# EAGLE design sumovore (EAGLE 4.14)
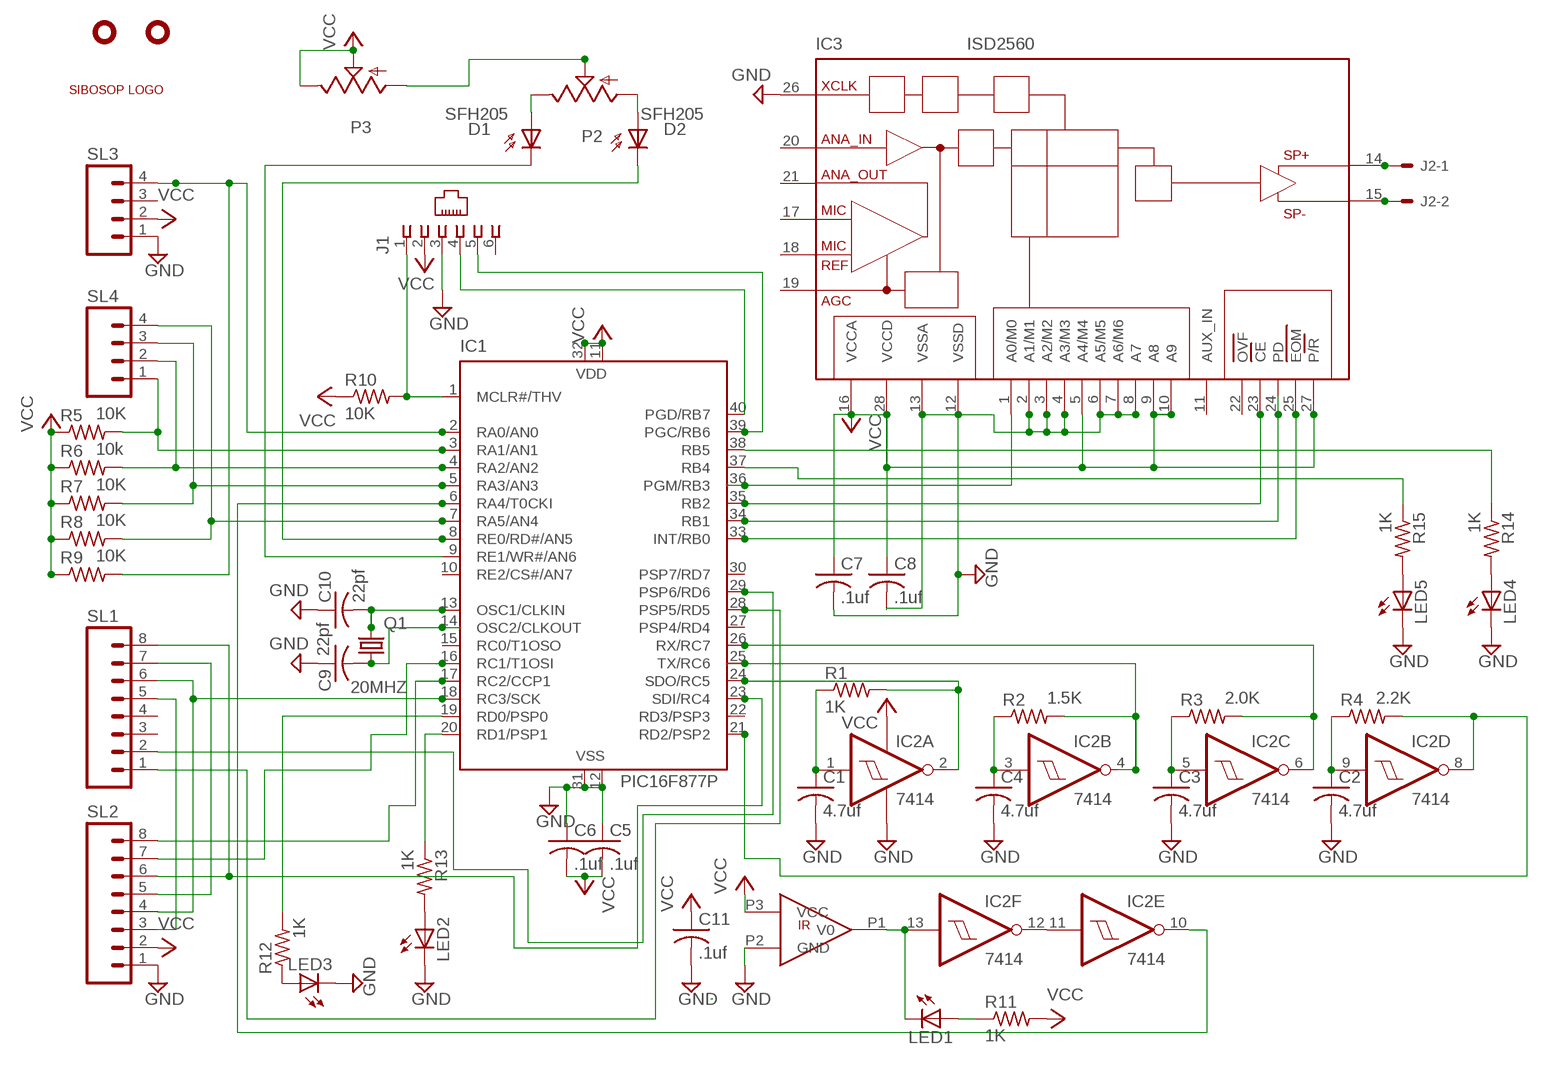
[diagram p0: schematic, sheet 1]

## Parts
C1  4.7uf  C-US050-024X044  [C050-024X044]
C2  4.7uf  C-US050-024X044  [C050-024X044]
C3  4.7uf  C-US050-024X044  [C050-024X044]
C4  4.7uf  C-US050-024X044  [C050-024X044]
C5  .1uf  C-US025-024X044  [C025-024X044]
C6  .1uf  C-US025-024X044  [C025-024X044]
C7  .1uf  C-US025-024X044  [C025-024X044]
C8  .1uf  C-US025-024X044  [C025-024X044]
C9  22pf  C-US025-024X044  [C025-024X044]
C10  22pf  C-US025-024X044  [C025-024X044]
C11  .1uf  C-US025-024X044  [C025-024X044]
D1  SFH205  [SFH205]
D2  SFH205  [SFH205]
IC1  PIC16F877P  [DIL40]
IC2  7414  [DIL14]
IC3  ISD2560  [DIL28-6]
J1  520250-3  [520250-3]
J2  22-27-2021-02  [6410-02]
LED1  LED5MM  [LED5MM]
LED2  LEDSQR2X5  [LED2X5]
LED3  LEDSQR2X5  [LED2X5]
LED4  LEDSQR2X5  [LED2X5]
LED5  LEDSQR2X5  [LED2X5]
P2  TRIMPOT  [RJ6S]
P3  TRIMPOT  [RJ6S]
Q1  20MHZ  CRYTALHC49S  [HC49/S]
R1  1K  R-US_0204/2V  [0204V]
R2  1.5K  R-US_0204/2V  [0204V]
R3  2.0K  R-US_0204/2V  [0204V]
R4  2.2K  R-US_0204/2V  [0204V]
R5  10K  R-US_0204/2V  [0204V]
R6  10k  R-US_0204/2V  [0204V]
R7  10K  R-US_0204/2V  [0204V]
R8  10K  R-US_0204/2V  [0204V]
R9  10K  R-US_0204/2V  [0204V]
R10  10K  R-US_0204/2V  [0204V]
R11  1K  R-US_0204/2V  [0204V]
R12  1K  R-US_0204/2V  [0204V]
R13  1K  R-US_0204/2V  [0204V]
R14  1K  R-US_0204/2V  [0204V]
R15  1K  R-US_0204/2V  [0204V]
SL1  M08  [08P]
SL2  M08  [08P]
SL3  M04  [04P]
SL4  M04  [04P]
U$1  LOGO  [LOGO]
U$2  PNA4062M  [LSTLR103NC-001]
U$4  HOLE-125  [HOLE-125]
U$8  HOLE-125  [HOLE-125]

## Nets
GND: C1.2 C2.2 C3.2 C4.2 C5.1 C6.1 C7.2 C8.2 C9.1 C10.1 C11.2 IC1.12(VSS) IC1.31(VSS) IC2.7(A:GND) IC3.2(A1/M1) IC3.3(A2/M2) IC3.4(A3/M3) IC3.6(A5/M5) IC3.7(A6/M6) IC3.8(A7) IC3.12(VSSD) IC3.13(VSSA) IC3.26(XCLK) J1.3 LED2.K(C) LED3.K(C) LED4.K(C) LED5.K(C) SL2.1 SL3.1 U$2.P2(GND)
N$1: C9.2 IC1.14(OSC2/CLKOUT) Q1.1
N$2: C10.2 IC1.13(OSC1/CLKIN) Q1.2
N$3: IC1.1(MCLR#/THV) J1.1 R10.2
N$4: IC1.40(PGD/RB7) J1.4
N$5: IC1.39(PGC/RB6) J1.5
N$6: IC3.15(SP-) J2.2
N$7: IC3.14(SP+) J2.1
N$8: IC1.33(INT/RB0) IC3.25(EOM)
N$9: IC2.11(E:I) IC2.12(F:O)
N$10: IC1.34(RB1) IC3.24(PD)
N$11: IC1.19(RD0/PSP0) R12.2
N$12: IC1.35(RB2) IC3.23(CE)
N$13: IC1.36(PGM/RB3) IC3.1(A0/M0)
N$14: IC1.3(RA1/AN1) R5.2 SL4.1
N$15: IC1.4(RA2/AN2) R6.2 SL4.2
N$16: IC1.2(RA0/AN0) R9.2 SL3.4
N$17: IC1.5(RA3/AN3) R7.2 SL4.3
N$18: IC1.7(RA5/AN4) R8.2 SL4.4
N$19: SL1.5 SL2.3
N$20: LED3.A R12.1
N$21: SL1.7 SL2.5
N$22: IC1.23(SDI/RC4) SL1.8 SL2.6
N$23: IC1.16(RC1/T1OSI) SL2.7
N$24: IC1.17(RC2/CCP1) SL2.8
N$25: IC1.18(RC3/SCK) SL1.6 SL2.4
N$26: IC1.20(RD1/PSP1) R13.1
N$27: LED2.A R13.2
N$28: IC1.29(PSP6/RD6) SL1.2
N$29: IC1.28(PSP5/RD5) SL1.1
N$31: IC2.13(F:I) LED1.K(C) U$2.P1(V0)
N$32: LED4.A R14.2
N$33: IC1.6(RA4/T0CKI) IC2.10(E:O)
N$34: C1.1 IC2.1(A:I) R1.1
N$35: IC1.24(SDO/RC5) IC2.2(A:O) R1.2
N$36: D2.A P2.A
N$37: C4.1 IC2.3(B:I) R2.1
N$38: IC1.25(TX/RC6) IC2.4(B:O) R2.2
N$39: C2.1 IC2.9(D:I) R4.1
N$40: D2.K(C) IC1.8(RE0/RD#/AN5)
N$41: C3.1 IC2.5(C:I) R3.1
N$42: IC1.26(RX/RC7) IC2.6(C:O) R3.2
N$43: D1.A P2.E
N$44: D1.K(C) IC1.9(RE1/WR#/AN6)
N$45: IC1.21(RD2/PSP2) IC2.8(D:O) R4.2
N$46: LED5.A R15.2
N$47: IC1.38(RB5) R14.1
N$48: LED1.A R11.1
N$49: IC1.37(RB4) R15.1
N$52: P2.S P3.A
VCC: C5.2 C6.2 C7.1 C8.1 C11.1 IC1.11(VDD) IC1.32(VDD) IC2.14(A:VCC) IC3.5(A4/M4) IC3.9(A8) IC3.10(A9) IC3.16(VCCA) IC3.27(P/R) IC3.28(VCCD) J1.2 P3.E P3.S R5.1 R6.1 R7.1 R8.1 R9.1 R10.1 R11.2 SL2.2 SL3.2 U$2.P3(VCC)
Unconnected: IC1.10(RE2/CS#/AN7) IC1.15(RC0/T1OSO) IC1.22(RD3/PSP3) IC1.27(PSP4/RD4) IC1.30(PSP7/RD7) IC3.11(AUX_IN) IC3.17(MIC) IC3.18(MIC_REF) IC3.19(AGC) IC3.20(ANA_IN) IC3.21(ANA_OUT) IC3.22(OVF) J1.6 SL1.3 SL1.4 SL3.3

## Library data of the parts
C1-C11 = rcl:C-US: CAPACITOR, American symbol
D1 D2 = opto-trans-siemens:SFH205: PHOTO DIODE
IC1 = microchip:PIC16F87*: MICROCONTROLLER
IC2 = sibosop:7414
IC3 = sibosop:ISD2560
J1 = con-amp:520250-3: AMP connector
J2 = ep_molex_6410_7395-02:22-?-02: CONNECTOR wire to board 2.54 mm (.1 inch) pitch header
LED1-LED5 = led:LED: LED OSRAM: - CHIPLED LG R971, LG N971, LY N971, LG Q971, LY Q971, LO R971, LY R971 LH N974, LH R974 LS Q976, LO Q976, LY Q976 LO Q996 - Hyper CHIPLED LW Q18S LB Q993, LB Q99A, LB R99A - SideLED LS A670, LO A670, LY A670, LG A670, LP A670 LB A673, LV A673, LT A673, LW A673 LH A674 LY A675 LS A676, LA A676, LO A676, LY A676, LW A676 LS A679, LY A679, LG A679 - Hyper Micro SIDELED® LS Y876, LA Y876, LO Y876, LY Y876 LT Y87S - SmartLED LW L88C, LW L88S LB L89C, LB L89S, LG L890 LS L89K, LO L89K, LY L89K LS L896, LA L896, LO L896, LY L896 - TOPLED LS T670, LO T670, LY T670, LG T670, LP T670 LSG T670, LSP T670, LSY T670, LOP T670, LYG T670 LG T671, LOG T671, LSG T671 LB T673, LV T673, LT T673, LW T673 LH T674 LS T676, LA T676, LO T676, LY T676, LB T676, LH T676, LSB T676, LW T676 LB T67C, LV T67C, LT T67C, LS T67K, LO T67K, LY T67K, LW E67C LS E67B, LA E67B, LO E67B, LY E67B, LB E67C, LV E67C, LT E67C LW T67C LS T679, LY T679, LG T679 LS T770, LO T770, LY T770, LG T770, LP T770 LB T773, LV T773, LT T773, LW T773 LH T774 LS E675, LA E675, LY E675, LS T675 LS T776, LA T776, LO T776, LY T776, LB T776 LHGB T686 LT T68C, LB T68C - Hyper Mini TOPLED® LB M676 - Mini TOPLED Santana® LG M470 LS M47K, LO M47K, LY M47K Source: http://www.osram.convergy.de/
P2 P3 = sibosop:TRIMPOT
Q1 = crystal:CRYTAL: CRYSTAL
R1-R15 = rcl:R-US_: RESISTOR, American symbol
SL1 SL2 = sibosop:M08: AMP QUICK CONNECTOR
SL3 SL4 = sibosop:M04: AMP QUICK CONNECTOR
U$1 = sibosop:LOGO
U$2 = sibosop:PNA4062M
U$4 U$8 = sibosop:HOLE-125

## Board
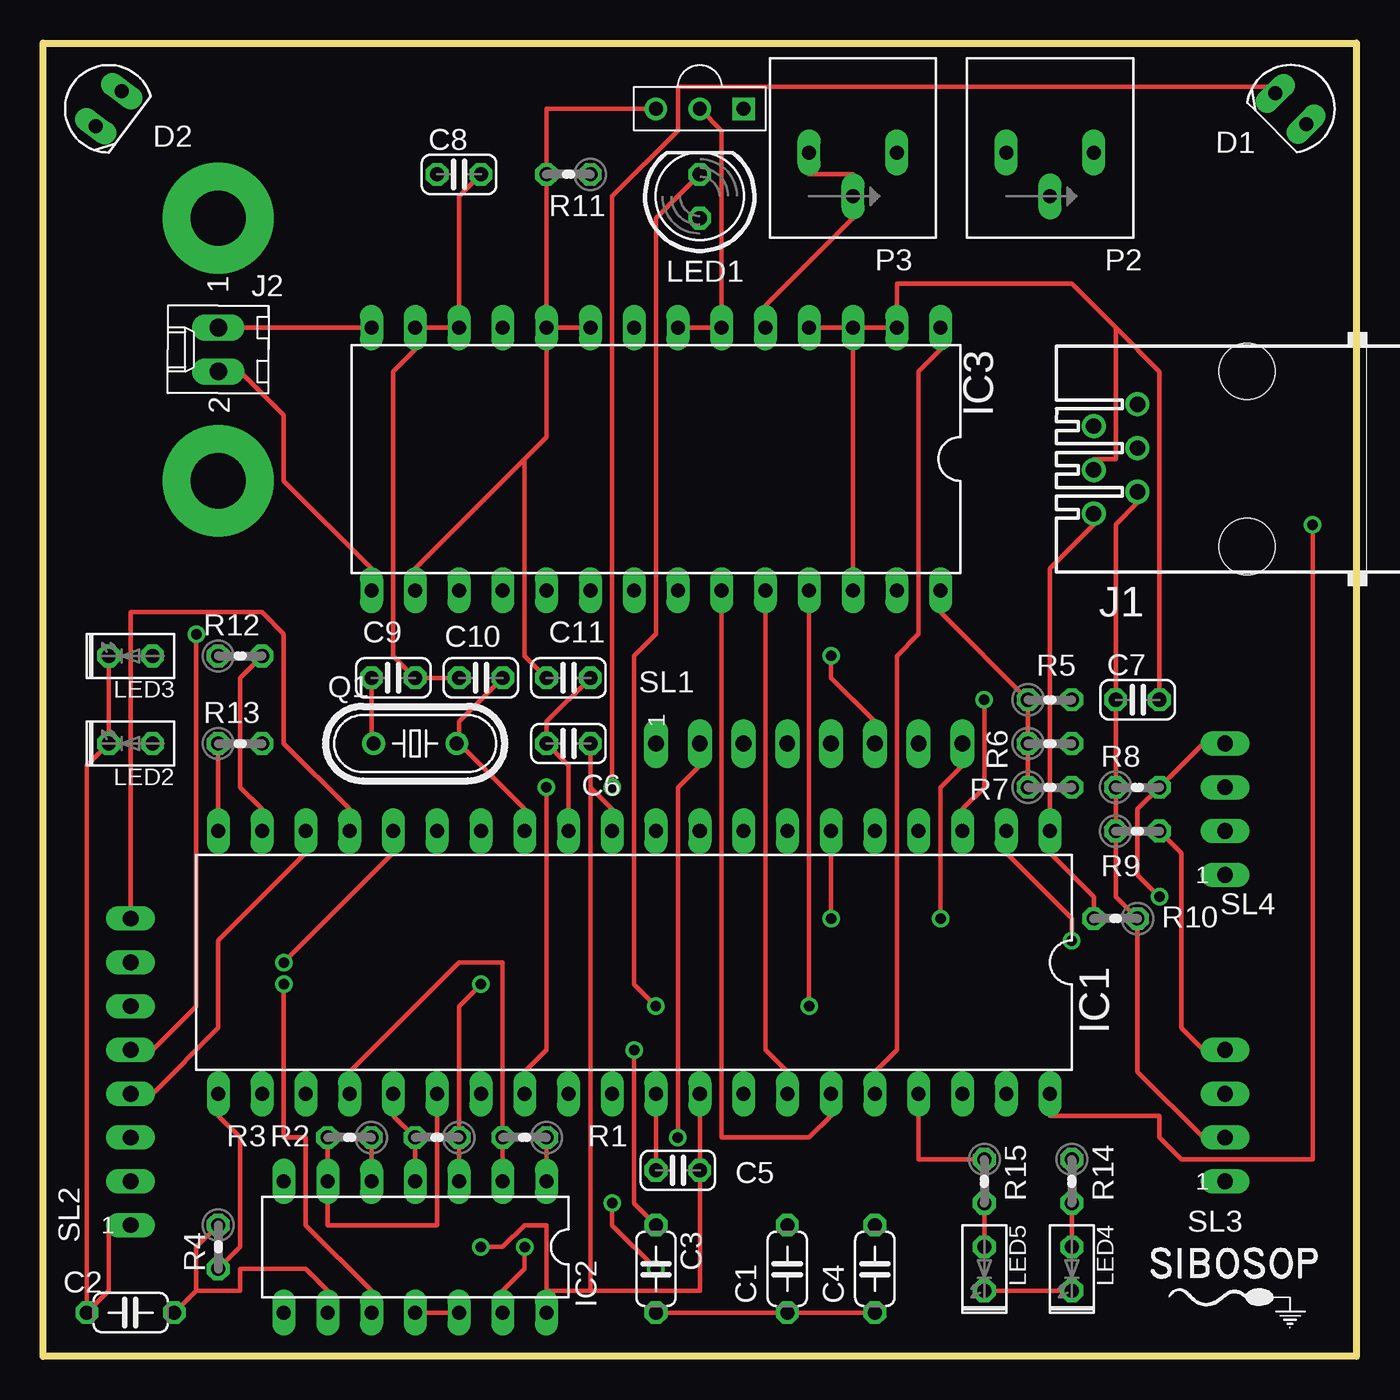
[diagram p1: board, top side]
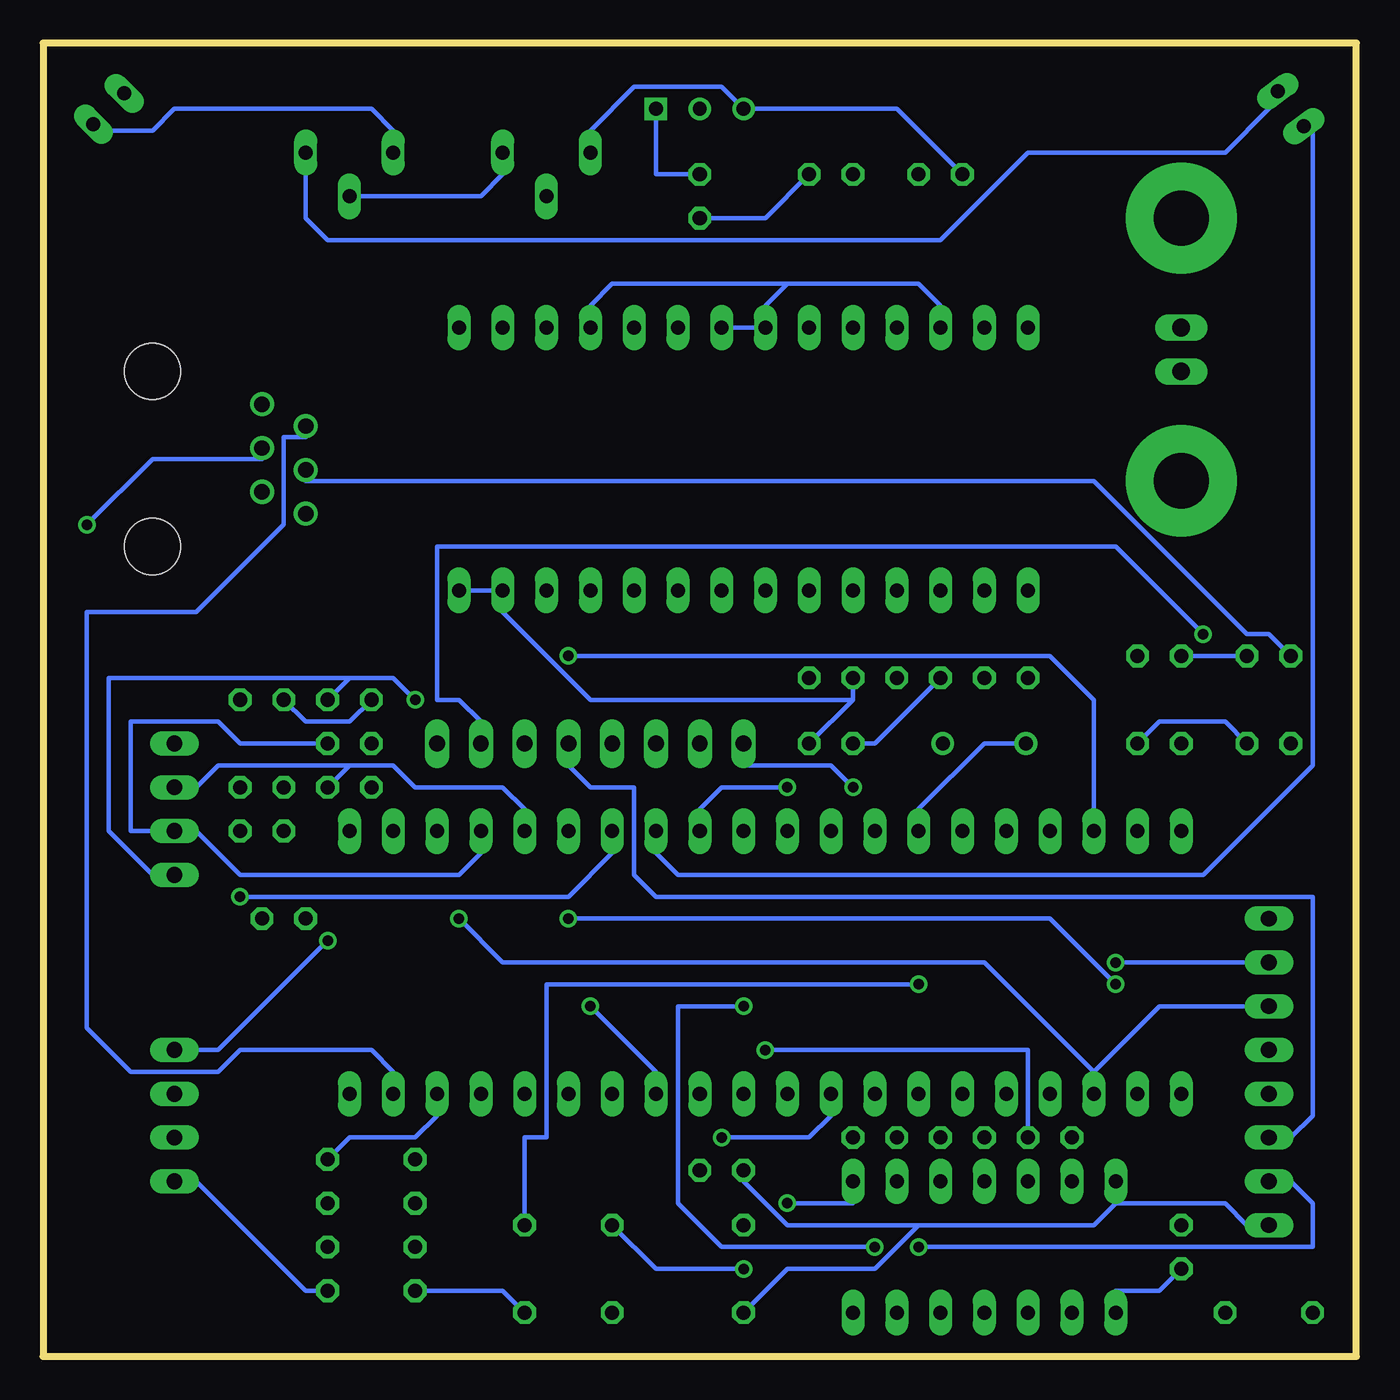
[diagram p2: board, bottom side, seen from below]

Size 76.2 x 76.2 mm. Coordinates in mm from the lower left corner, seen from the top.
Outline: 0,0 0,76.2 76.2,76.2 76.2,0 0,0
Copper layers (1*16): Top 0.035mm / dielectric 1.5mm / Bottom 0.035mm
Design rules "default": minimum track width 10mil, minimum drill 24mil, track to track 8mil, track to pad 8mil, pad to pad 8mil, via to via 8mil, smd to smd 8mil, copper to edge 40mil, drill to drill 8mil, minimum pad ring 10mil, minimum via ring 8mil, stop-mask expansion 4mil, vias tented up to drill 0mil, thermal gap 10mil

### Footprints (pad centres in the part's own frame; a part is rotated, then mirrored left to right if it is on the bottom)
C050-024X044 = drill 0.813 octagon: 1 -2.54,0; 2 2.54,0
C025-024X044 = drill 0.813 octagon: 1 -1.27,0; 2 1.27,0
SFH205 = drill 0.813 long: A 0,-1.27; K 0,1.27
DIL40 = drill 0.813 long: 1 -24.13,-7.62; 2 -21.59,-7.62; 3 -19.05,-7.62; 4 -16.51,-7.62; 5 -13.97,-7.62; 6 -11.43,-7.62; 7 -8.89,-7.62; 8 -6.35,-7.62; 9 -3.81,-7.62; 10 -1.27,-7.62; 11 1.27,-7.62; 12 3.81,-7.62; 13 6.35,-7.62; 14 8.89,-7.62; 15 11.43,-7.62; 16 13.97,-7.62; 17 16.51,-7.62; 18 19.05,-7.62; 19 21.59,-7.62; 20 24.13,-7.62; 21 24.13,7.62; 22 21.59,7.62; 23 19.05,7.62; 24 16.51,7.62; 25 13.97,7.62; 26 11.43,7.62; 27 8.89,7.62; 28 6.35,7.62; 29 3.81,7.62; 30 1.27,7.62; 31 -1.27,7.62; 32 -3.81,7.62; 33 -6.35,7.62; 34 -8.89,7.62; 35 -11.43,7.62; 36 -13.97,7.62; 37 -16.51,7.62; 38 -19.05,7.62; 39 -21.59,7.62; 40 -24.13,7.62
DIL14 = drill 0.813 long: 1 -7.62,-3.81; 2 -5.08,-3.81; 3 -2.54,-3.81; 4 0,-3.81; 5 2.54,-3.81; 6 5.08,-3.81; 7 7.62,-3.81; 8 7.62,3.81; 9 5.08,3.81; 10 2.54,3.81; 11 0,3.81; 12 -2.54,3.81; 13 -5.08,3.81; 14 -7.62,3.81
DIL28-6 = drill 0.813 long: 1 -16.51,-7.62; 2 -13.97,-7.62; 3 -11.43,-7.62; 4 -8.89,-7.62; 5 -6.35,-7.62; 6 -3.81,-7.62; 7 -1.27,-7.62; 8 1.27,-7.62; 9 3.81,-7.62; 10 6.35,-7.62; 11 8.89,-7.62; 12 11.43,-7.62; 13 13.97,-7.62; 14 16.51,-7.62; 15 16.51,7.62; 16 13.97,7.62; 17 11.43,7.62; 18 8.89,7.62; 19 6.35,7.62; 20 3.81,7.62; 21 1.27,7.62; 22 -1.27,7.62; 23 -3.81,7.62; 24 -6.35,7.62; 25 -8.89,7.62; 26 -11.43,7.62; 27 -13.97,7.62; 28 -16.51,7.62
520250-3 = drill 0.889 round: 1 -3.175,8.89; 2 -1.905,6.35; 3 -0.635,8.89; 4 0.635,6.35; 5 1.905,8.89; 6 3.175,6.35 | hole 3.251: -5.08,0; 5.08,0
6410-02 = drill 1.016 long: 1 1.27,0; 2 -1.27,0
LED5MM = drill 0.813 octagon: A -1.27,0; K 1.27,0
LED2X5 = drill 0.813 octagon: A -1.27,0; K 1.27,0
RJ6S = drill 0.813 long: A 2.54,0; E -2.54,0; S 0,-2.54
HC49/S = drill 0.813 round: 1 -2.413,0; 2 2.413,0
0204V = drill 0.813 octagon: 1 -1.27,0; 2 1.27,0
08P = drill 0.914 long: 1 -8.89,0; 2 -6.35,0; 3 -3.81,0; 4 -1.27,0; 5 1.27,0; 6 3.81,0; 7 6.35,0; 8 8.89,0
04P = drill 0.914 long: 1 -3.81,0; 2 -1.27,0; 3 1.27,0; 4 3.81,0
LSTLR103NC-001 = drill 0.8 square: P1 -2.54,0 | drill 0.8 round: P2 0,0; P3 2.54,0
HOLE-125 = drill 3.2 pad 6.452 round: P$1 0,0

### Placement (x,y rotation side)
C1  43.18,5.08 270 top
C2  5.08,2.54 180 top
C3  35.56,5.08 270 top
C4  48.26,5.08 270 top
C5  36.83,10.79 0 top
C6  30.48,35.56 0 top
C7  63.5,38.1 0 top
C8  24.13,68.58 0 top
C9  20.32,39.37 180 top
C10  25.4,39.37 0 top
C11  30.48,39.37 0 top
D1  72.39,72.39 45 top
D2  3.81,72.39 143.3 top
IC1  34.29,22.86 180 top
IC2  21.59,6.35 180 top
IC3  35.56,52.07 180 top
J1  69.85,52.07 90 top
J2  10.16,58.42 90 top
LED1  38.1,67.31 90 top
LED2  5.08,35.56 180 top
LED3  5.08,40.64 180 top
LED4  59.69,5.08 270 top
LED5  54.61,5.08 270 top
P2  58.42,69.85 0 top
P3  46.99,69.85 0 top
Q1  21.59,35.56 0 top
R1  27.94,12.7 180 top
R2  22.86,12.7 180 top
R3  17.78,12.7 180 top
R4  10.16,6.35 270 top
R5  58.42,38.1 0 top
R6  58.42,35.56 0 top
R7  58.42,33.02 0 top
R8  63.5,33.02 0 top
R9  63.5,30.48 0 top
R10  62.23,25.4 180 top
R11  30.48,68.58 180 top
R12  11.43,40.64 0 top
R13  11.43,35.56 0 top
R14  59.69,10.16 270 top
R15  54.61,10.16 270 top
SL1  44.45,35.56 0 top
SL2  5.08,16.51 90 top
SL3  68.58,13.97 90 top
SL4  68.58,31.75 90 top
U$1  68.58,5.08 0 top
U$2  38.1,72.39 180 top
U$4  10.16,66.04 0 top
U$8  10.16,50.8 0 top

### Tracks (layer width: path | path; a pad name or v marks a point on that pad's centre or on a via)
GND
  Top 0.254: IC3.3 IC3.4 | IC3.3 IC3.26 | IC3.3 IC3.2 49.53,62.23 59.69,62.23 62.23,59.69 | C7.2 64.77,57.15 62.23,59.69 | 62.23,59.69 62.23,52.07 60.96,52.07 J1.3 | C10.1 C9.1 20.32,40.64 20.32,57.15 21.59,58.42 IC3.13 IC3.12 24.13,67.31 C8.2 | IC1.12 30.48,34.29 C6.1 29.21,36.83 C11.2 | U$2.P2 39.37,71.12 IC3.6 IC3.7 | C3.2 C1.2 C4.2 | LED5.K LED4.K | LED3.K LED2.K 2.54,34.29 C2.2 3.81,3.81 3.81,7.62 SL2.1 | C5.1 IC1.31
  Bottom 0.254: C10.1 27.94,35.56 C6.1 | IC3.7 IC3.8 34.29,60.96 33.02,62.23 | 33.02,62.23 25.4,62.23 24.13,60.96 IC3.12 | 33.02,62.23 43.18,62.23 44.45,60.96 IC3.4 | LED4.K 60.96,3.81 67.31,10.16 SL3.1 | C4.2 49.53,3.81 LED5.K | 13.97,8.89 7.62,8.89 6.35,7.62 SL2.1 | 25.4,7.62 15.24,7.62 13.97,8.89 | 25.4,7.62 33.02,7.62 35.56,10.16 C5.1 | 13.97,8.89 IC2.7 | C3.2 33.02,5.08 27.94,5.08 25.4,7.62 | LED3.K 5.08,41.91 6.35,41.91 15.24,50.8 60.96,50.8 J1.3
N$1
  Top 0.254: C9.2 19.05,35.56 Q1.1
  Bottom 0.254: IC1.14 25.4,31.75 21.59,35.56 Q1.1 19.05,35.56
N$2
  Top 0.254: 24.13,35.56 27.94,31.75 IC1.13 | C10.2 24.13,36.83 24.13,35.56 | 24.13,35.56 Q1.2
N$3
  Top 0.254: R10.2 60.96,26.67 58.42,29.21 IC1.1 58.42,45.72 60.96,48.26 J1.1
N$4  (via drill 0.61)
  Top 0.254: v73.66,48.26 73.66,11.43 66.04,11.43 64.77,12.7 64.77,13.97 58.42,13.97 IC1.40
  Bottom 0.254: v73.66,48.26 69.85,52.07 63.5,52.07 J1.4
N$5
  Bottom 0.254: IC1.39 55.88,16.51 57.15,17.78 64.77,17.78 66.04,16.51 71.12,16.51 73.66,19.05 73.66,43.18 67.31,43.18 62.23,48.26 62.23,53.34 60.96,53.34 J1.5
N$6
  Top 0.254: IC3.15 19.05,45.72 13.97,50.8 13.97,54.61 11.43,57.15 J2.2
N$7
  Top 0.254: J2.1 IC3.14
N$8  (via drill 0.61)
  Top 0.254: v44.45,20.32 IC3.25
  Bottom 0.254: v44.45,20.32 40.64,16.51 IC1.33
N$9
  Top 0.254: IC2.11 IC2.12
N$10
  Top 0.254: IC1.34 43.18,16.51 41.91,17.78 IC3.24
N$11
  Top 0.254: R12.2 11.43,39.37 11.43,33.02 12.7,31.75 IC1.19
N$12
  Top 0.254: IC1.35 45.72,13.97 44.45,12.7 39.37,12.7 IC3.23
N$13
  Top 0.254: IC1.36 48.26,16.51 49.53,17.78 49.53,40.64 50.8,41.91 50.8,57.15 52.07,58.42 IC3.1
N$14  (via drill 0.61)
  Top 0.254: v54.61,38.1 54.61,33.02 53.34,31.75 IC1.3
  Bottom 0.254: v54.61,38.1 55.88,39.37 58.42,39.37 | 58.42,39.37 R5.2 | 58.42,39.37 72.39,39.37 72.39,30.48 69.85,27.94 SL4.1
N$15
  Bottom 0.254: IC1.4 50.8,29.21 52.07,27.94 64.77,27.94 67.31,30.48 SL4.2 71.12,30.48 71.12,36.83 66.04,36.83 64.77,35.56 R6.2
N$16  (via drill 0.61)
  Top 0.254: v59.69,24.13 59.69,25.4 55.88,29.21 IC1.2 | R9.2 66.04,29.21 66.04,19.05 67.31,17.78 SL3.4
  Bottom 0.254: v59.69,24.13 66.04,17.78 SL3.4
N$17
  Bottom 0.254: 58.42,34.29 55.88,34.29 54.61,33.02 49.53,33.02 48.26,31.75 IC1.5 | 58.42,34.29 R7.2 | 58.42,34.29 66.04,34.29 67.31,33.02 SL4.3
N$18  (via drill 0.61)
  Top 0.254: v64.77,26.67 63.5,27.94 63.5,31.75 R8.2 67.31,35.56 SL4.4
  Bottom 0.254: v64.77,26.67 45.72,26.67 43.18,29.21 IC1.7
N$19
  Bottom 0.254: SL2.3 3.81,12.7 2.54,13.97 2.54,26.67 40.64,26.67 41.91,27.94 41.91,33.02 44.45,33.02 45.72,34.29 SL1.5
N$20
  Bottom 0.254: LED3.A R12.1
N$21  (via drill 0.61)
  Top 0.254: v8.89,41.91 8.89,20.32 6.35,17.78 SL2.5
  Bottom 0.254: v8.89,41.91 13.97,46.99 53.34,46.99 53.34,38.1 52.07,38.1 50.8,36.83 SL1.7
N$22  (via drill 0.61)
  Top 0.254: v52.07,25.4 52.07,33.02 53.34,34.29 SL1.8
  Bottom 0.254: 15.24,16.51 11.43,20.32 SL2.6 | v52.07,25.4 49.53,22.86 21.59,22.86 15.24,16.51 | 15.24,16.51 IC1.23
N$23  (via drill 0.61)
  Top 0.254: v13.97,22.86 20.32,29.21 IC1.16
  Bottom 0.254: SL2.7 v13.97,22.86
N$24
  Top 0.254: SL2.8 5.08,43.18 12.7,43.18 13.97,41.91 13.97,35.56 17.78,31.75 IC1.17
N$25  (via drill 0.61)
  Top 0.254: IC1.18 15.24,29.21 10.16,24.13 10.16,19.05 6.35,15.24 SL2.4 | v45.72,40.64 45.72,39.37 48.26,36.83 SL1.6
  Bottom 0.254: v45.72,40.64 17.78,40.64 15.24,38.1 IC1.18
N$26
  Top 0.254: IC1.20 R13.1
N$27
  Bottom 0.254: LED2.A 7.62,36.83 11.43,36.83 R13.2
N$28  (via drill 0.61)
  Top 0.254: v36.83,12.7 36.83,33.02 38.1,34.29 SL1.2
  Bottom 0.254: v36.83,12.7 31.75,12.7 30.48,13.97 IC1.29
N$29  (via drill 0.61)
  Top 0.254: v29.21,33.02 29.21,17.78 27.94,16.51 IC1.28
  Bottom 0.254: v29.21,33.02 30.48,34.29 35.56,34.29 SL1.1
N$31  (via drill 0.61)
  Top 0.254: v27.94,6.35 27.94,5.08 26.67,3.81 IC2.13 | v35.56,20.32 34.29,21.59 34.29,40.64 35.56,41.91 35.56,66.04 LED1.K
  Bottom 0.254: U$2.P1 40.64,68.58 LED1.K | v27.94,6.35 36.83,6.35 39.37,8.89 39.37,20.32 v35.56,20.32
N$32
  Top 0.254: LED4.A R14.2
N$33  (via drill 0.61)
  Top 0.254: v13.97,21.59 13.97,12.7 15.24,12.7 15.24,7.62 19.05,3.81 IC2.10 | v45.72,25.4 IC1.6
  Bottom 0.254: v13.97,21.59 17.78,25.4 v45.72,25.4
N$34  (via drill 0.61)
  Top 0.254: IC2.1 R1.1 | v35.56,5.08 33.02,7.62 v33.02,8.89
  Bottom 0.254: C1.1 40.64,5.08 v35.56,5.08 | v33.02,8.89 29.21,8.89 IC2.1
N$35
  Top 0.254: IC2.2 R1.2 26.67,22.86 24.13,22.86 17.78,16.51 IC1.24
N$36
  Bottom 0.254: D2.A 5.08,72.39 7.62,69.85 19.05,69.85 24.13,64.77 59.69,64.77 60.96,66.04 P2.A
N$37  (via drill 0.61)
  Top 0.254: IC2.3 R2.1 24.13,20.32 v25.4,21.59
  Bottom 0.254: C4.1 48.26,12.7 46.99,12.7 46.99,21.59 v25.4,21.59
N$38
  Top 0.254: IC2.4 R2.2 20.32,13.97 IC1.25
N$39
  Top 0.254: C2.1 8.89,3.81 | 8.89,3.81 8.89,6.35 R4.1 | 8.89,3.81 11.43,3.81 11.43,5.08 15.24,5.08 16.51,3.81 IC2.9
N$40
  Bottom 0.254: IC1.8 40.64,29.21 39.37,27.94 8.89,27.94 2.54,34.29 2.54,71.12 D2.K
N$41  (via drill 0.61)
  Top 0.254: IC2.5 R3.1 | C3.1 34.29,8.89 v34.29,17.78
  Bottom 0.254: v34.29,17.78 19.05,17.78 R3.1
N$42
  Top 0.254: R3.2 IC2.6 16.51,7.62 22.86,7.62 IC1.26
N$43
  Bottom 0.254: P2.E 55.88,71.12 57.15,72.39 68.58,72.39 69.85,71.12 72.39,71.12 D1.A
N$44  (via drill 0.61)
  Top 0.254: v33.02,33.02 33.02,67.31 36.83,71.12 36.83,73.66 71.12,73.66 D1.K
  Bottom 0.254: v33.02,33.02 36.83,33.02 38.1,31.75 IC1.9
N$45
  Top 0.254: R4.2 11.43,6.35 11.43,12.7 10.16,13.97 IC1.21
  Bottom 0.254: R4.2 11.43,3.81 13.97,3.81 IC2.8
N$46
  Top 0.254: LED5.A R15.2
N$47
  Bottom 0.254: R14.1 58.42,12.7 54.61,12.7 53.34,13.97 IC1.38
N$48
  Bottom 0.254: R11.1 34.29,66.04 LED1.A
N$49
  Top 0.254: R15.1 50.8,11.43 IC1.37
N$52
  Bottom 0.254: P2.S 50.8,67.31 49.53,68.58 P3.A
VCC  (via drill 0.61)
  Top 0.254: R7.1 R6.1 R5.1 52.07,43.18 IC3.28 | J1.2 63.5,49.53 62.23,48.26 C7.1 R8.1 R9.1 62.23,26.67 R10.1 63.5,16.51 67.31,12.7 SL3.2 | 31.75,3.81 38.1,3.81 C5.2 IC1.32 | 29.21,3.81 31.75,3.81 | v25.4,6.35 26.67,6.35 27.94,7.62 29.21,7.62 29.21,3.81 | 29.21,3.81 IC2.14 | IC3.5 41.91,60.96 46.99,66.04 P3.S 46.99,68.58 44.45,68.58 P3.E | U$2.P3 29.21,72.39 R11.2 IC3.10 | 31.75,33.02 C6.2 | 31.75,33.02 33.02,31.75 IC1.11 | 27.94,52.07 29.21,53.34 IC3.10 | 27.94,52.07 21.59,45.72 IC3.16 | C11.1 27.94,40.64 27.94,52.07 | IC3.10 IC3.9 | 31.75,3.81 31.75,33.02
  Bottom 0.254: IC3.28 IC3.27 49.53,43.18 44.45,38.1 29.21,38.1 | R5.1 58.42,36.83 60.96,36.83 C7.1 | v25.4,6.35 2.54,6.35 2.54,8.89 3.81,10.16 SL2.2 | C8.1 26.67,72.39 U$2.P3 36.83,73.66 41.91,73.66 44.45,71.12 P3.E | C6.2 29.21,38.1 | 29.21,38.1 C11.1

### Text on the board
tPlace: C:/Documents and Settings/Administrator/Desktop/sibosop.bmp
tOrigins: C:/Documents and Settings/Administrator/Desktop/sibosop.bmp